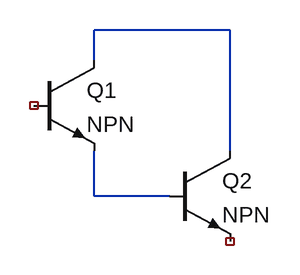
[diagram p0: schematic maida.asc]
maida.asc, the LTspice schematic file:
Version 4
SHEET 1 880 680
WIRE 256 -16 112 -16
WIRE 112 16 112 -16
WIRE 256 112 256 -16
WIRE 112 160 112 112
WIRE 192 160 112 160
SYMBOL npn 48 16 R0
SYMATTR InstName Q1
SYMBOL npn 192 112 R0
SYMATTR InstName Q2

The netlist it stands for:
* maida.asc
Q1 N001 NC_01 N002 0 NPN
Q2 N001 N002 NC_02 0 NPN
.model NPN NPN
.model PNP PNP
.lib standard.bjt
.backanno
.end